# EAGLE schematic 411_REV0 (EAGLE 9.2.1)
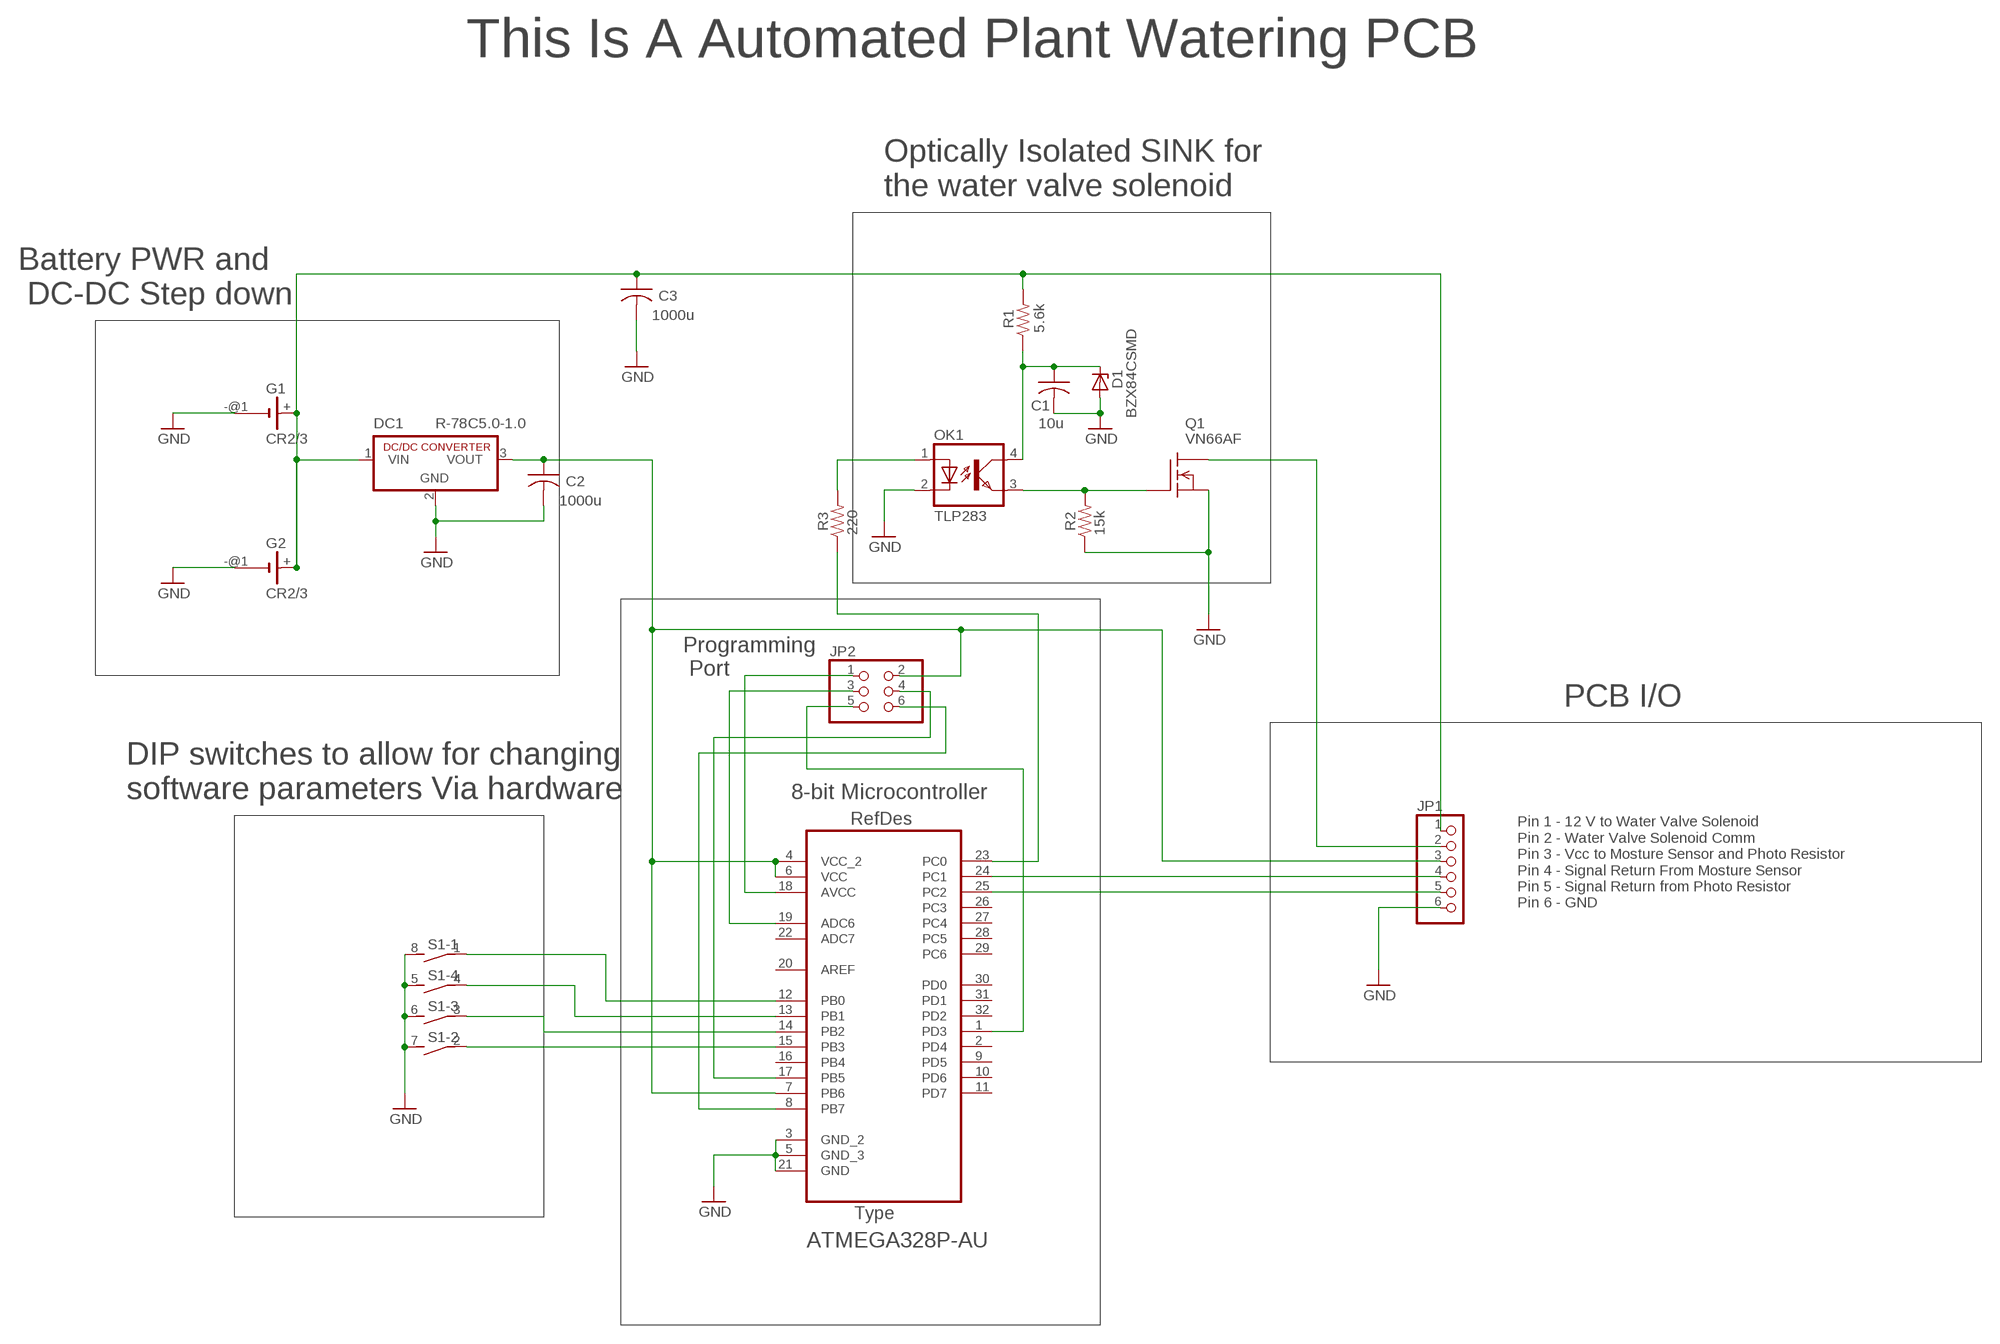
[diagram p0: schematic, sheet 1]

## Parts
ATMEGA328  ATMEGA328P-AU  [QFP80P900X900X120-32N]
C1  C-USC0805  [C0805]
C2  C-USC0805  [C0805]
C3  C-USC0805  [C0805]
D1  BZX84CSMD  [TO236]
DC1  R-78C5.0-1.0  [SIP3]
G1  CR2/3  [CR2/3]
G2  CR2/3  [CR2/3]
JP1  PINHD-1X6  [1X06]
JP2  PINHD-2X3  [2X03]
OK1  TLP283  [MINI-FLAT-4]
Q1  VN66AF  [TO202]
R1  R-US_M0805  [M0805]
R2  R-US_M0805  [M0805]
R3  R-US_M0805  [M0805]
S1  DIP04S  [DIP04S]

## Nets
GND: ATMEGA328.3(GND_2) ATMEGA328.5(GND_3) ATMEGA328.21(GND) C1.2 C2.2 C3.2 D1.A DC1.2(GND) G1.-@1(-) G2.-@1(-) JP1.6 OK1.2(C) Q1.1(S) R2.1 S1.5 S1.6 S1.7 S1.8
N$1: ATMEGA328.23(PC0) R3.1
N$2: ATMEGA328.18(AVCC) JP2.1
N$3: C3.1 DC1.1(VIN) G1.+ G2.+ JP1.1 R1.2
N$4: ATMEGA328.17(PB5) JP2.4
N$5: ATMEGA328.19(ADC6) JP2.3
N$6: ATMEGA328.8(PB7) JP2.6
N$7: ATMEGA328.1(PD3) JP2.5
N$8: OK1.3(EMIT) Q1.2(G) R2.2
N$9: C1.1 D1.C OK1.4(COL) R1.1
N$10: ATMEGA328.13(PB1) S1.4
N$11: JP1.2 Q1.3(D)
N$12: ATMEGA328.12(PB0) S1.1
N$13: ATMEGA328.14(PB2) S1.3
N$14: ATMEGA328.15(PB3) S1.2
N$15: OK1.1(A) R3.2
N$16: ATMEGA328.24(PC1) JP1.4
N$17: ATMEGA328.25(PC2) JP1.5
VCC: ATMEGA328.4(VCC_2) ATMEGA328.6(VCC) ATMEGA328.7(PB6) C2.1 DC1.3(VOUT) JP1.3 JP2.2
Unconnected: ATMEGA328.2(PD4) ATMEGA328.9(PD5) ATMEGA328.10(PD6) ATMEGA328.11(PD7) ATMEGA328.16(PB4) ATMEGA328.20(AREF) ATMEGA328.22(ADC7) ATMEGA328.26(PC3) ATMEGA328.27(PC4) ATMEGA328.28(PC5) ATMEGA328.29(PC6) ATMEGA328.30(PD0) ATMEGA328.31(PD1) ATMEGA328.32(PD2) G1.-@2(-) G2.-@2(-)

## Notes on the sheet
- This Is A Automated Plant Watering PCB
- Optically Isolated SINK for 
  the water valve solenoid
- Battery PWR and
   DC-DC Step down
- Programming
   Port
- PCB I/O
- DIP switches to allow for changing 
  software parameters Via hardware
- Pin 1 - 12 V to Water Valve Solenoid
  Pin 2 - Water Valve Solenoid Comm
  Pin 3 - Vcc to Mosture Sensor and Photo Resistor
  Pin 4 - Signal Return From Mosture Sensor
  Pin 5 - Signal Return from Photo Resistor
  Pin 6 - GND

## Library data of the parts
ATMEGA328 = Atmel-ATMEGA328P-AU:ATMEGA328P-AU; DESCRIPTION: 8-bit Microcontroller; MPN: ATMEGA328P-AU; OC_FARNELL: 1715486; OC_NEWARK: 14R4631; PACKAGE: TQFP-32; SUPPLIER: Atmel
C1 = resistor:C-US: CAPACITOR, American symbol; C: 10u
C2 C3 = resistor:C-US: CAPACITOR, American symbol; C: 1000u
D1 = diode:BZX84CSMD: Z DIODE
DC1 = dc-dc-converter:R-78C*-1.0: INNOLINE DC/DC-Converter 1.0 AMP SIP3 Single Output Source: Data sheet <http://www.mikrocontroller.net/attachment/150645/157764-da-01-en-DC_DC_WANDLER_R_78C5_0_1_0.pdf>
G1 G2 = battery:CR2/3: LI BATTERY Sonnenschein SL-361 PT
JP1 = pinhead:PINHD-1X6: PIN HEADER
JP2 = pinhead:PINHD-2X3: PIN HEADER
OK1 = optocoupler:TLP283: TOSHIBA PHOTOCOUPLER GaAs IRED & PHOTO-TRANSISTOR Source: http://www.semicon.toshiba.co.jp/td/en/Opto/Photocoupler/en_20050928_TLP283_datasheet.pdf; OC_FARNELL: unknown; OC_NEWARK: unknown
Q1 = transistor-fet:VN66AF: N-Channel Enhancement MOSFET 60V; 2A; 3,0Ohm
R1 = resistor:R-US_: RESISTOR, American symbol; R: 5.6k
R2 = resistor:R-US_: RESISTOR, American symbol; R: 15k
R3 = resistor:R-US_: RESISTOR, American symbol; R: 220
S1 = switch-dil:DIP04S: DIL/CODE SWITCH; OC_FARNELL: unknown; OC_NEWARK: unknown